# EAGLE design Pi Pico WSPR TX with GPS (EAGLE 9.6.2)
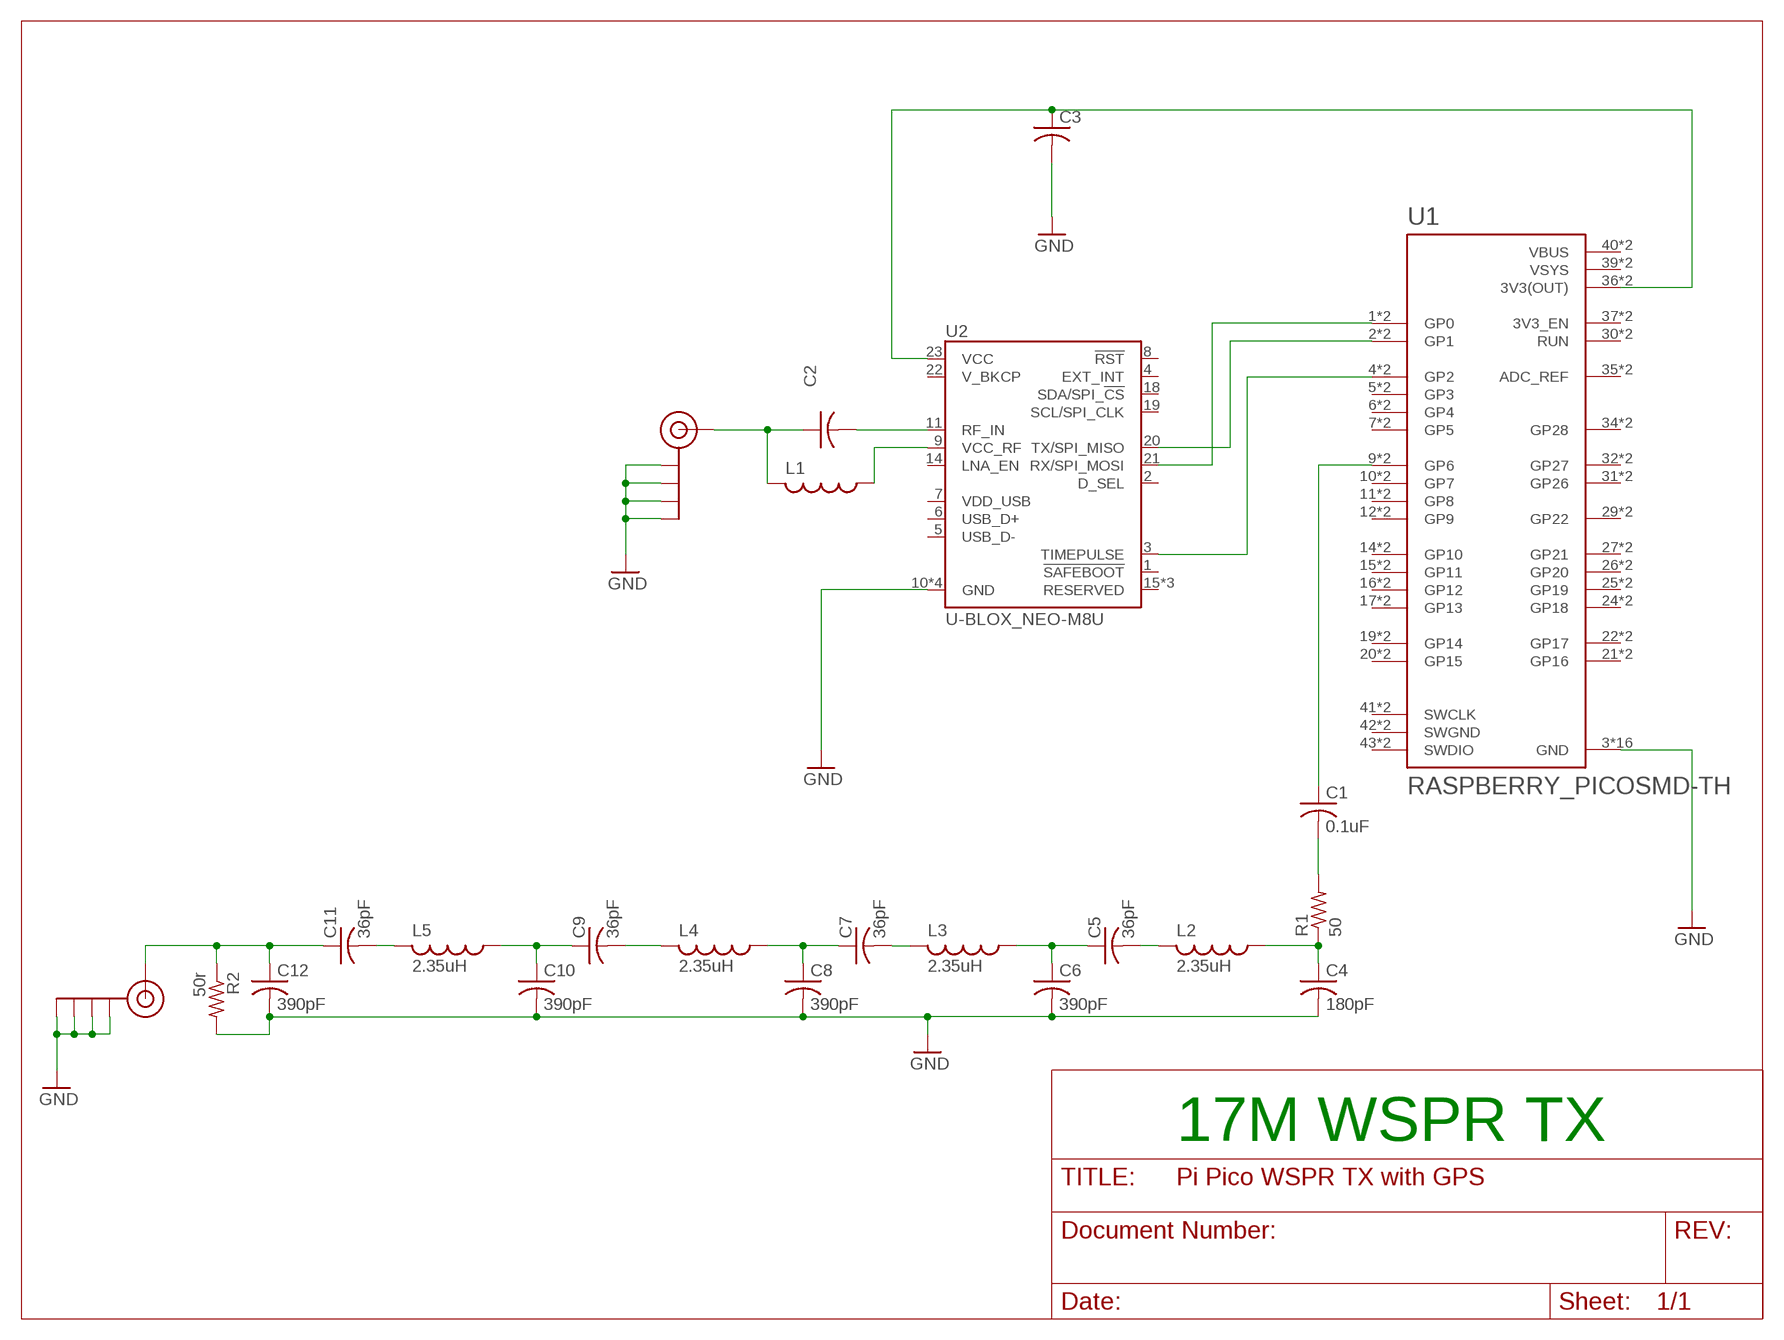
[diagram p0: schematic, sheet 1]

## Parts
C1  0.1uF  C-USC0603  [C0603]
C2  C-USC0603  [C0603]
C3  C-USC0603  [C0603]
C4  180pF  C-USC0603  [C0603]
C5  36pF  C-USC0603  [C0603]
C6  390pF  C-USC0603  [C0603]
C7  36pF  C-USC0603  [C0603]
C8  390pF  C-USC0603  [C0603]
C9  36pF  C-USC0603  [C0603]
C10  390pF  C-USC0603  [C0603]
C11  36pF  C-USC0603  [C0603]
C12  390pF  C-USC0603  [C0603]
J$1  SMA_EDGE  [SMA-EDGE]
J$2  SMA_EDGE  [SMA-EDGE]
L1  L-USL2012C  [L2012C]
L2  2.35uH  L-USL2012C  [L2012C]
L3  2.35uH  L-USL2012C  [L2012C]
L4  2.35uH  L-USL2012C  [L2012C]
L5  2.35uH  L-USL2012C  [L2012C]
R1  50  R-US_R0603  [R0603]
R2  50r  R-US_R0603  [R0603]
U1  RASPBERRY_PICOSMD-TH  [PICO-PKG]
U2  U-BLOX_NEO-M8U  [NEO-M9N/M8T/M8U/D9S/F9P]

## Nets
GND: C3.2 C4.2 C6.2 C8.2 C10.2 C12.2 J$1.GND@0(GND) J$1.GND@1(GND) J$1.GND@2(GND) J$1.GND@3(GND) J$2.GND@0(GND) J$2.GND@1(GND) J$2.GND@2(GND) J$2.GND@3(GND) R2.2 U1.3(GND) U1.8(GND) U1.13(GND) U1.18(GND) U1.23(GND) U1.28(GND) U1.33(GND) U1.38(GND) U1.P$3(GND) U1.P$8(GND) U1.P$13(GND) U1.P$18(GND) U1.P$23(GND) U1.P$28(GND) U1.P$33(GND) U1.P$38(GND) U2.10(GND) U2.12(GND) U2.13(GND) U2.24(GND)
N$1: C2.1 J$1.SIG(SIGNAL) L1.2
N$2: C3.1 U1.36(3V3(OUT)) U1.P$36(3V3(OUT)) U2.23(VCC)
N$3: U1.4(GP2) U1.P$4(GP2) U2.3(TIMEPULSE)
N$4: C1.1 U1.9(GP6) U1.P$9(GP6)
N$5: U1.1(GP0) U1.P$1(GP0) U2.21(RX/SPI_MOSI)
N$6: U1.2(GP1) U1.P$2(GP1) U2.20(TX/SPI_MISO)
N$7: C1.2 R1.2
N$8: C2.2 U2.11(RF_IN)
N$9: L1.1 U2.9(VCC_RF)
N$10: C11.2 L5.2
N$11: C4.1 L2.1 R1.1
N$12: C5.2 L2.2
N$13: C5.1 C6.1 L3.1
N$14: C7.2 L3.2
N$15: C7.1 C8.1 L4.1
N$16: C9.2 L4.2
N$17: C9.1 C10.1 L5.1
N$18: C11.1 C12.1 J$2.SIG(SIGNAL) R2.1
Unconnected: U1.5(GP3) U1.6(GP4) U1.7(GP5) U1.10(GP7) U1.11(GP8) U1.12(GP9) U1.14(GP10) U1.15(GP11) U1.16(GP12) U1.17(GP13) U1.19(GP14) U1.20(GP15) U1.21(GP16) U1.22(GP17) U1.24(GP18) U1.25(GP19) U1.26(GP20) U1.27(GP21) U1.29(GP22) U1.30(RUN) U1.31(GP26) U1.32(GP27) U1.34(GP28) U1.35(ADC_REF) U1.37(3V3_EN) U1.41(SWCLK) U1.43(SWDIO) U1.P$5(GP3) U1.P$6(GP4) U1.P$7(GP5) U1.P$10(GP7) U1.P$11(GP8) U1.P$12(GP9) U1.P$14(GP10) U1.P$15(GP11) U1.P$16(GP12) U1.P$17(GP13) U1.P$19(GP14) U1.P$20(GP15) U1.P$21(GP16) U1.P$22(GP17) U1.P$24(GP18) U1.P$25(GP19) U1.P$26(GP20) U1.P$27(GP21) U1.P$29(GP22) U1.P$30(RUN) U1.P$31(GP26) U1.P$32(GP27) U1.P$34(GP28) U1.P$35(ADC_REF) U1.P$37(3V3_EN) U1.P$41(SWCLK) U1.P$43(SWDIO) U2.1(!SAFEBOOT!) U2.2(D_SEL) U2.4(EXT_INT) U2.5(USB_D-) U2.6(USB_D+) U2.7(VDD_USB) U2.8(!RST) U2.14(LNA_EN) U2.15(RESERVED) U2.16(RESERVED) U2.17(RESERVED) U2.18(SDA/SPI_!CS!) U2.19(SCL/SPI_CLK) U2.22(V_BKCP)

## Notes on the sheet
- 17M WSPR TX

## Power pins joined to a net without a drawn wire
SWGND: U1.42(SWGND) U1.P$42(SWGND)
VBUS: U1.40(VBUS) U1.P$40(VBUS)
VSYS: U1.39(VSYS) U1.P$39(VSYS)

## Library data of the parts
C1-C12 = rcl:C-US: CAPACITOR, American symbol; SPICEPREFIX: C
J$1 J$2 = SparkFun-Retired:SMA_EDGE: SMA Antenna Connector End launch SMA connector. The paste layer has been removed so that the connector can be hand soldered onto the board after reflow.
L1-L5 = rcl:L-US: INDUCTOR, American symbol; SPICEPREFIX: L
R1 R2 = rcl:R-US_: RESISTOR, American symbol; SPICEPREFIX: R
U1 = RpiPico:RASPBERRY_PICO: Raspberry Pi Pico
U2 = SparkFun-GPS:U-BLOX_NEO-M8U: u-blox NEO-M8U The NEO-M8U module introduces u-blox’s Untethered Dead Reckoning (UDR) technology, which provides continuous navigation without requiring speed information from the vehicle. This innovative technology brings the benefits of dead reckoning to installations previously restricted to using GNSS alone, and significantly reduces the cost of installation for after-market dead reckoning applications. The strength of UDR is particularly apparent under poor signal conditions, where it brings continuous positioning in urban environments, even to devices with antennas installed within the vehicle. Useful positioning performance is also available during complete signal loss, for example in parking garages and short tunnels. With UDR, positioning starts as soon as power is applied to the module, before the first GNSS fix is available. The NEO-M8U may be installed in any position within the vehicle without configuration. In addition to its freedom from any electrical connection to the vehicle, the on-board accelerometer and gyroscope sensors result in a fully self-contained solution, perfect for rapid product development with reliable and consistent performance.; PROD_ID: IC-14850

## Board
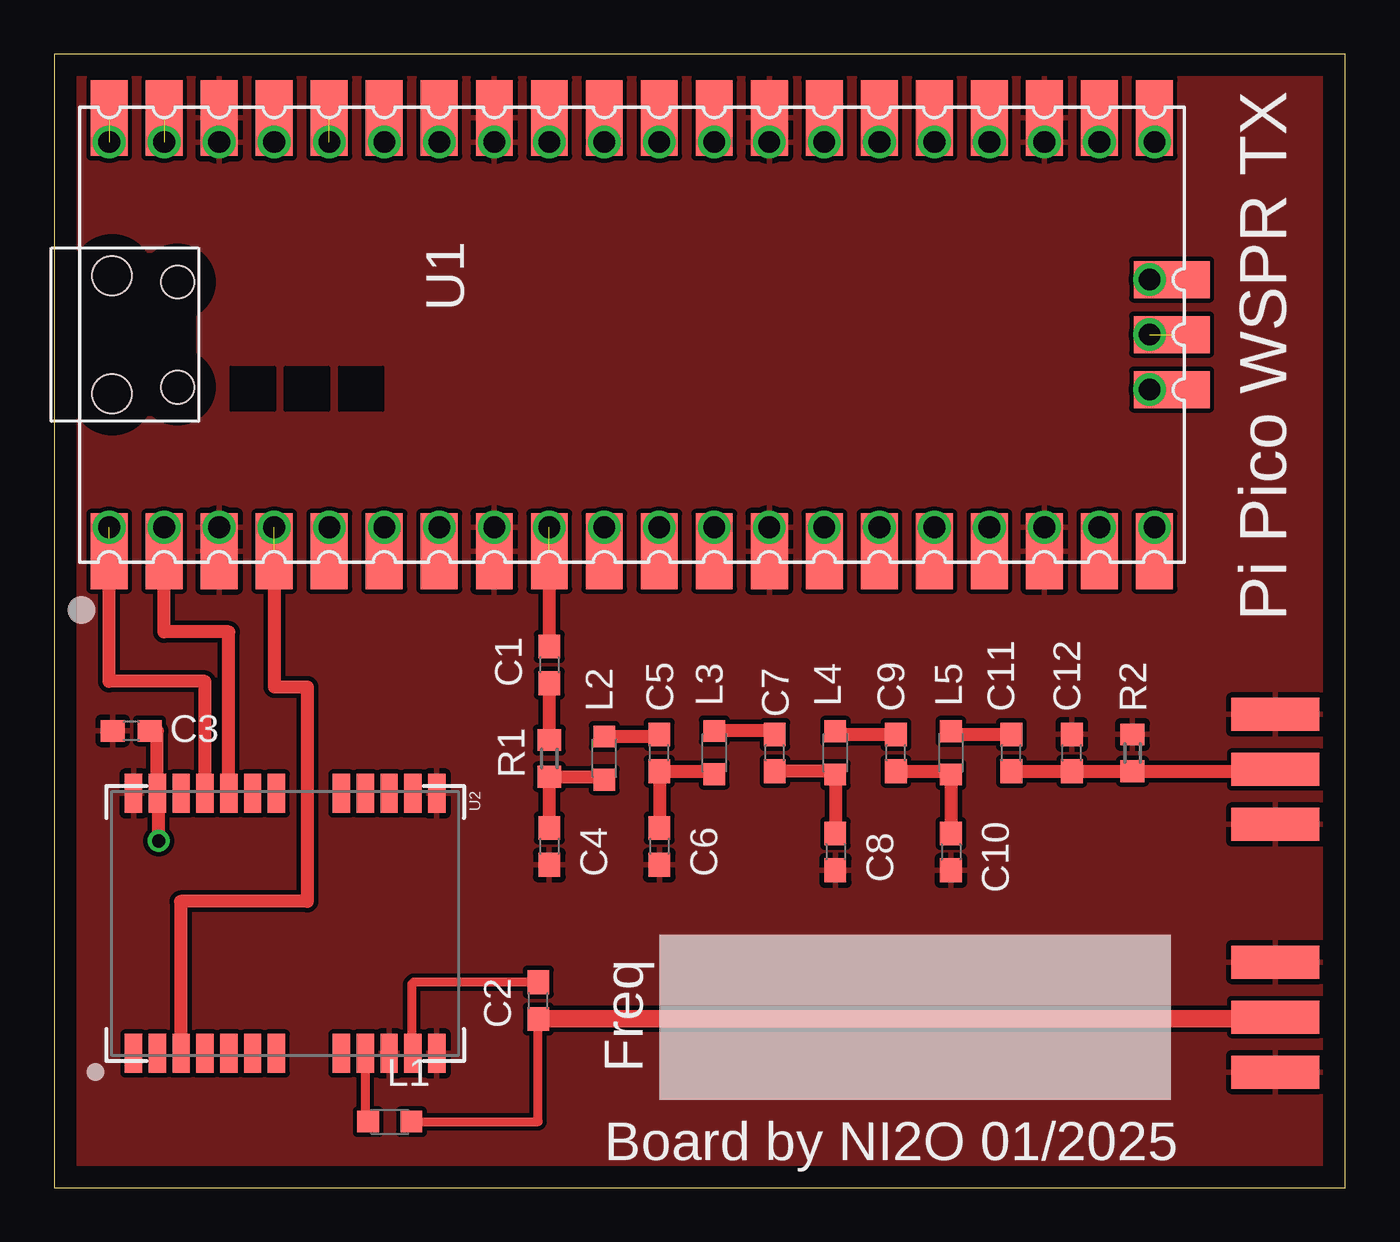
[diagram p1: board, top side]
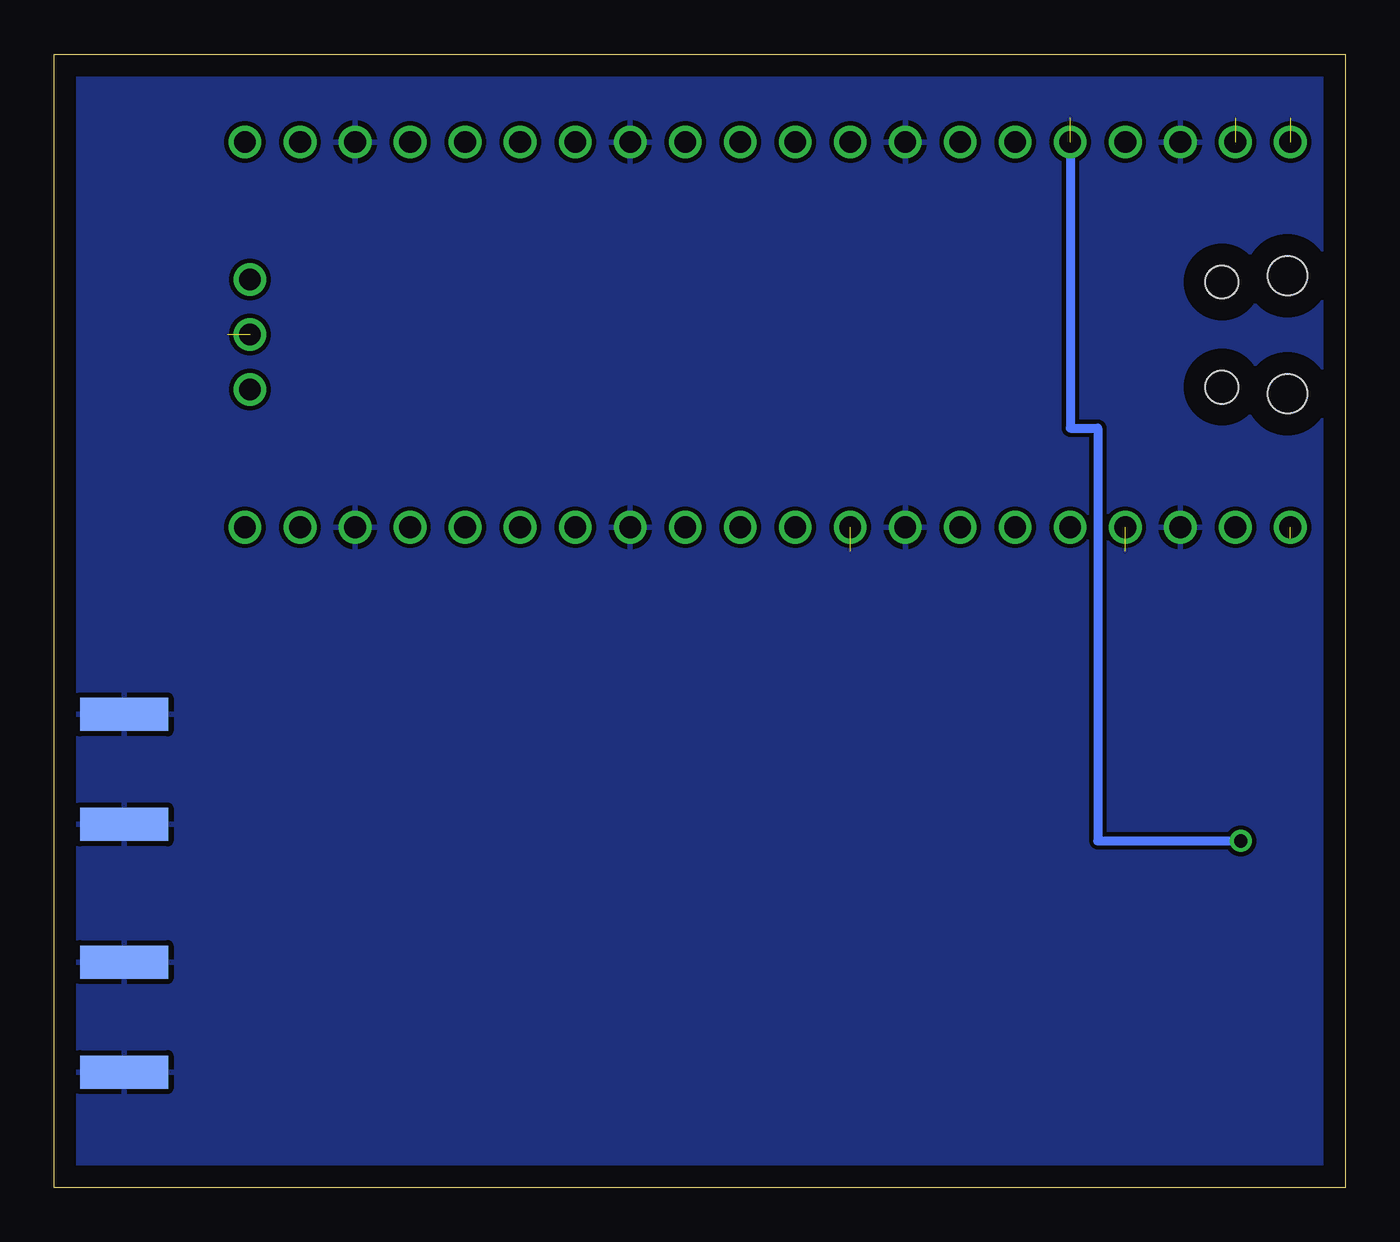
[diagram p2: board, bottom side, seen from below]

Size 59.61 x 52.31 mm. Coordinates in mm from the lower left corner, seen from the top.
Outline: 0,0 59.61,0 59.61,52.31 0,52.31 0,0
Copper layers (1*16): Top 0.035mm / dielectric 1.5mm / Bottom 0.035mm
Design rules "default": minimum track width 10mil, minimum drill 24mil, track to track 8mil, track to pad 8mil, pad to pad 8mil, via to via 8mil, smd to smd 8mil, copper to edge 40mil, drill to drill 8mil, minimum pad ring 10mil, minimum via ring 8mil, stop-mask expansion 4mil, vias tented up to drill 0mil, thermal gap 10mil

### Footprints (pad centres in the part's own frame; a part is rotated, then mirrored left to right if it is on the bottom)
C0603 = smd 1.1 x 1: 1 -0.85,0; 2 0.85,0
SMA-EDGE = smd 1.524 x 4.064: GND@0 0,0; GND@1 5.08,0; SIG 2.54,0 | smd 1.524 x 4.064 bottom: GND@2 0,0; GND@3 5.08,0
L2012C = smd 1 x 1: 1 -1,0; 2 1,0
R0603 = smd 1 x 1.1: 1 -0.85,0; 2 0.85,0
PICO-PKG = drill 1: 1 -8.89,24.13; 2 -8.89,21.59; 3 -8.89,19.05; 4 -8.89,16.51; 5 -8.89,13.97; 6 -8.89,11.43; 7 -8.89,8.89; 8 -8.89,6.35; 9 -8.89,3.81; 10 -8.89,1.27; 11 -8.89,-1.27; 12 -8.89,-3.81; 13 -8.89,-6.35; 14 -8.89,-8.89; 15 -8.89,-11.43; 16 -8.89,-13.97; 17 -8.89,-16.51; 18 -8.89,-19.05; 19 -8.89,-21.59; 20 -8.89,-24.13; 21 8.89,-24.13; 22 8.89,-21.59; 23 8.89,-19.05; 24 8.89,-16.51; 25 8.89,-13.97; 26 8.89,-11.43; 27 8.89,-8.89; 28 8.89,-6.35; 29 8.89,-3.81; 30 8.89,-1.27; 31 8.89,1.27; 32 8.89,3.81; 33 8.89,6.35; 34 8.89,8.89; 35 8.89,11.43; 36 8.89,13.97; 37 8.89,16.51; 38 8.89,19.05; 39 8.89,21.59; 40 8.89,24.13; 41 -2.54,-23.9; 42 0,-23.9; 43 2.54,-23.9 | smd 3.5 x 1.7: P$1 -10,24.13; P$2 -10,21.59; P$3 -10,19.05; P$4 -10,16.51; P$5 -10,13.97; P$6 -10,11.43; P$7 -10,8.89; P$8 -10,6.35; P$9 -10,3.81; P$10 -10,1.27; P$11 -10,-1.27; P$12 -10,-3.81; P$13 -10,-6.35; P$14 -10,-8.89; P$15 -10,-11.43; P$16 -10,-13.97; P$17 -10,-16.51; P$18 -10,-19.05; P$19 -10,-21.59; P$20 -10,-24.13; P$21 10,-24.13; P$22 10,-21.59; P$23 10,-19.05; P$24 10,-16.51; P$25 10,-13.97; P$26 10,-11.43; P$27 10,-8.89; P$28 10,-6.35; P$29 10,-3.81; P$30 10,-1.27; P$31 10,1.27; P$32 10,3.81; P$33 10,6.35; P$34 10,8.89; P$35 10,11.43; P$36 10,13.97; P$37 10,16.51; P$38 10,19.05; P$39 10,21.59; P$40 10,24.13 | smd 1.7 x 3.5: P$41 -2.54,-24.925; P$42 0,-24.925; P$43 2.54,-24.925 | hole 1.8: -2.725,24; 2.725,24 | hole 1.5: -2.425,20.97; 2.425,20.97
NEO-M9N/M8T/M8U/D9S/F9P = smd 1.8 x 0.8: 1 6,-7; 2 6,-5.9; 3 6,-4.8; 4 6,-3.7; 5 6,-2.6; 6 6,-1.5; 7 6,-0.4; 8 6,2.6; 9 6,3.7; 10 6,4.8; 11 6,5.9; 12 6,7; 13 -6,7; 14 -6,5.9; 15 -6,4.8; 16 -6,3.7; 17 -6,2.6; 18 -6,-0.4; 19 -6,-1.5; 20 -6,-2.6; 21 -6,-3.7; 22 -6,-4.8; 23 -6,-5.9; 24 -6,-7

### Placement (x,y rotation side)
C1  22.86,24.13 270 top
C2  22.35,8.64 90 top
C3  3.56,21.08 180 top
C4  22.86,15.75 270 top
C5  27.94,20.07 90 top
C6  27.94,15.75 270 top
C7  33.27,20.07 90 top
C8  36.07,15.49 270 top
C9  38.86,20.07 90 top
C10  41.4,15.49 270 top
C11  44.2,20.07 90 top
C12  46.99,20.07 90 top
J$1  56.39,10.41 270 top
J$2  56.39,21.84 270 top
L1  15.49,3.05 0 top
L2  25.4,19.83 90 top
L3  30.48,20.08 90 top
L4  36.07,20.07 90 top
L5  41.4,20.07 90 top
R1  22.86,19.81 90 top
R2  49.78,20.07 90 top
U1  26.67,39.37 90 top
U2  10.67,12.19 270 top

### Tracks (layer width: path | path; a pad name or v marks a point on that pad's centre or on a via)
GND
  pour Top: 0,-0.25 59.69,-0.25 59.69,52.32 0,52.32
  pour Bottom: 0,-0.25 59.69,-0.25 59.69,52.32 0,52.32
N$1
  Top 0.406: L1.2 22.35,3.05 C2.1 | 56.39,7.79 J$1.SIG
  Top 0.813: C2.1 56.39,7.79
N$2  (via drill 0.61)  (1 unrouted)
  Top 0.61: v4.83,16 4.83,18.19 U2.23 4.77,21.08 C3.1
  Bottom 0.406: U1.36 12.7,35.05 11.43,35.05 11.43,16 v4.83,16
N$3  (1 unrouted)
  Top 0.61: U1.P$4 10.16,23.11 11.68,23.11 11.68,13.21 5.84,13.21 5.84,6.19 U2.3
N$4  (1 unrouted)
  Top 0.61: U1.P$9 C1.1
N$5  (1 unrouted)
  Top 0.61: U2.21 6.97,23.37 2.54,23.37 U1.P$1 2.54,29.97
N$6
  Top 0.61: U2.20 8.07,25.65 5.08,25.65 U1.P$2 U1.2
N$7
  Top 0.61: C1.2 R1.2
N$8
  Top 0.406: C2.2 16.6,9.49 16.51,9.4 16.51,6.25 U2.11
N$9
  Top 0.406: U2.9 14.37,3.05 L1.1
N$10
  Top 0.61: L5.2 41.4,20.92 C11.2
N$11
  Top 0.61: C4.1 R1.1 25.4,18.96 L2.1
N$12
  Top 0.61: L2.2 27.94,20.83 C5.2
N$13
  Top 0.61: L3.1 30.48,19.22 C5.1 C6.1
N$14
  Top 0.61: C7.2 33.11,21.08 L3.2
N$15
  Top 0.61: C7.1 35.92,19.22 L4.1 C8.1
N$16
  Top 0.61: L4.2 36.07,20.92 C9.2
N$17
  Top 0.61: C9.1 41.4,19.22 L5.1 C10.1
N$18
  Top 0.61: C11.1 C12.1 R2.1 56.39,19.22 J$2.SIG
SWGND  (1 unrouted)
VBUS  (1 unrouted)
VSYS  (1 unrouted)

### Text on the board
tNames: Pi Pico WSPR TX | Freq | Board by NI2O 01/2025